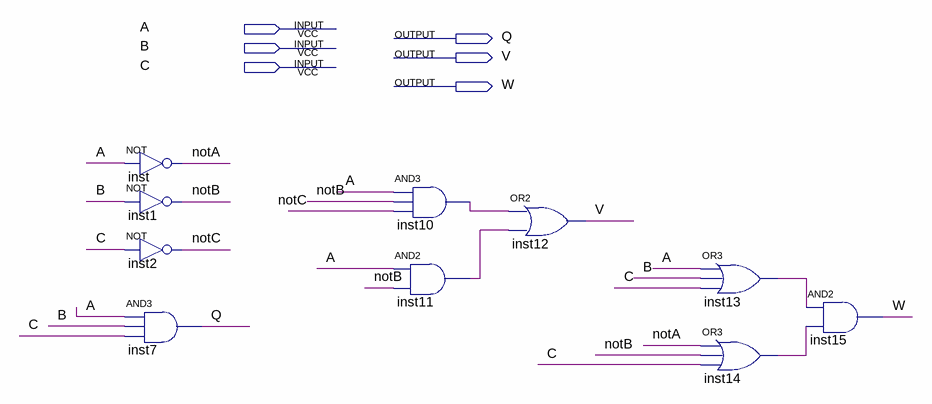
[diagram p0: schematic sheet]
// Quartus schematic lab2.bdf as structural Verilog: 10 symbols, 6 pins
module lab2 (
  input  A,
  input  B,
  input  C,
  output Q,
  output V,
  output W
);

  wire inst10_out, inst11_out, inst13_out, inst14_out, notA, notB, notC;

  not inst (notA, A);
  not inst1 (notB, B);
  not inst2 (notC, C);
  and inst7 (Q, A, B, C);
  and inst10 (inst10_out, A, notB, notC);
  and inst11 (inst11_out, A, notB);
  or inst12 (V, inst10_out, inst11_out);
  or inst13 (inst13_out, A, B, C);
  or inst14 (inst14_out, notA, notB, C);
  and inst15 (W, inst13_out, inst14_out);
endmodule
